# Altium project veniceBienale-IRFan-B.PrjPCB
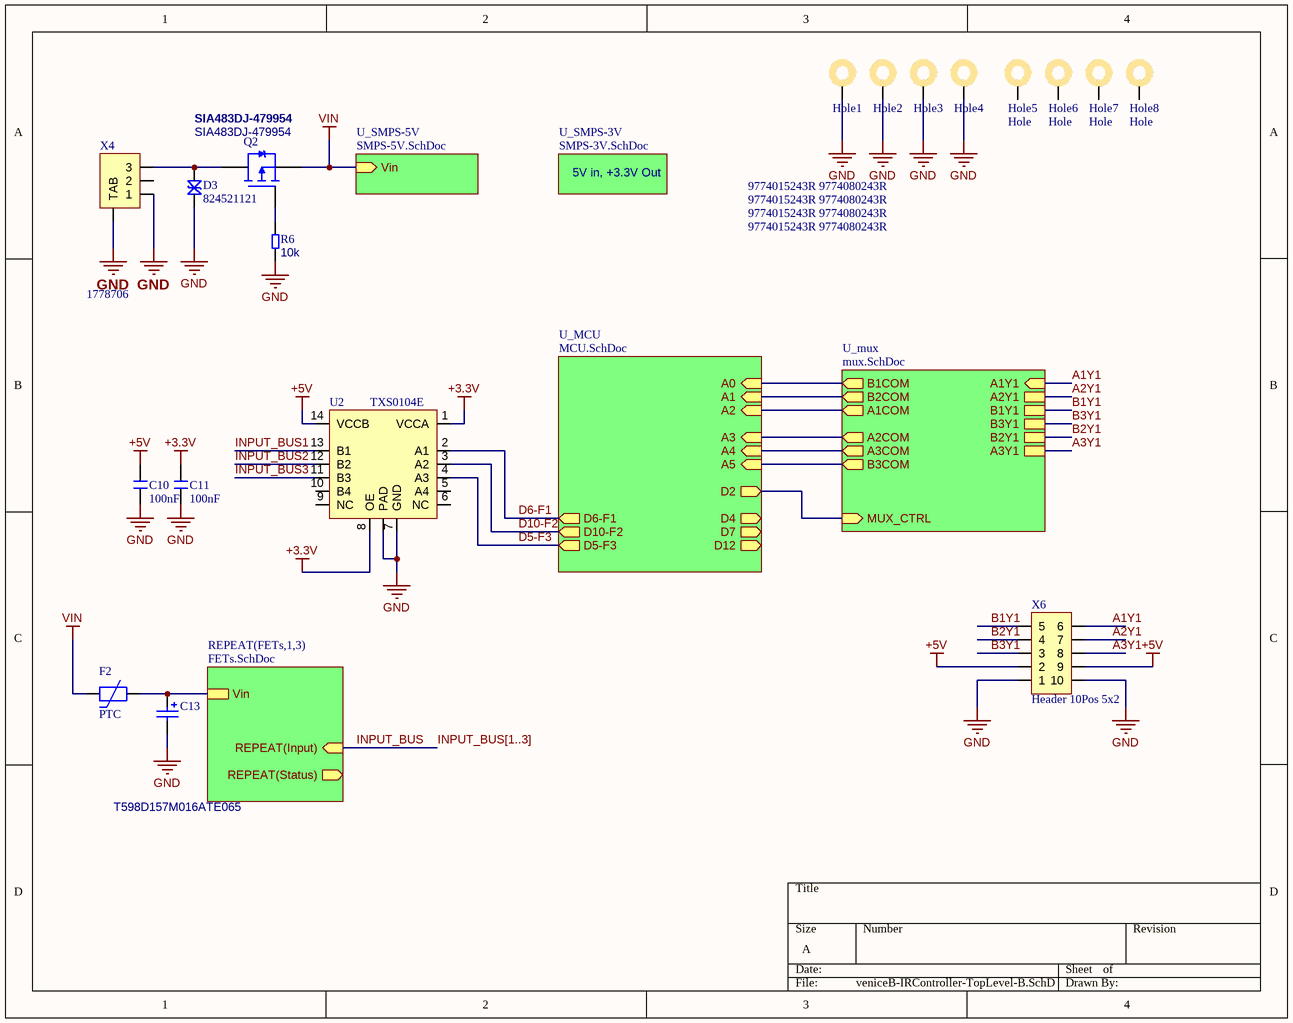
[diagram p0: veniceB-IRController-TopLevel-B.SchDoc]
6 sheets, 98 parts. Net scope: hierarchical (ports join the sheet entries above them; power ports are global).
Board file: veniceBienale-IRFan-B.PcbDoc
Sheets:
  veniceB-IRController-TopLevel-B.SchDoc
    U_MCU = MCU.SchDoc
    FETs1 = FETs.SchDoc
    FETs2 = FETs.SchDoc
    FETs3 = FETs.SchDoc
    U_SMPS-5V = SMPS-5V.SchDoc
    U_SMPS-3V = SMPS-3V.SchDoc
    U_mux = mux.SchDoc

## Sheet veniceB-IRController-TopLevel-B.SchDoc
size A

### Parts
C10  100nF  [C0603_N]
C11  100nF  [C0603_N]
C13  T598D157M016ATE065  [2917 - Case D]
D3  824521121  [DO214AC SMA]
F2  PTC  [1812]
Hole1  9774015243R 9774080243R  [Insert-Thread-SMD-M2]
Hole2  9774015243R 9774080243R  [Insert-Thread-SMD-M2]
Hole3  9774015243R 9774080243R  [Insert-Thread-SMD-M2]
Hole4  9774015243R 9774080243R  [Insert-Thread-SMD-M2]
Hole5  Hole  [M2.5 HOLE]
Hole6  Hole  [M2.5 HOLE]
Hole7  Hole  [M2.5 HOLE]
Hole8  Hole  [M2.5 HOLE]
Q2  SIA483DJ-479954  [SC70-6L]
R6  10k  [R0603]
U2  TXS0104E  [QFN-14]
X4  1778706  [PTSM-3W-V-SMD]
X6  Header 10Pos 5x2  [Header 5x2 SMD 2.54mm]

### Sub-sheets
REPEAT(FETs,1,3) = FETs.SchDoc: REPEAT(Input) (in), REPEAT(Status) (out), Vin
U_MCU = MCU.SchDoc: D10-F2 (out), D6-F1 (out), D5-F3 (out), D7 (out), D12 (out), D2 (out), D4 (out), A4 (in), A2 (in), A0 (in), A1 (in), A3 (in), A5 (in)
U_mux = mux.SchDoc: MUX_CTRL (in), A2COM (out), A1COM (out), B3COM (out), A3COM (out), B2COM (out), B1COM (out), A1Y1 (in), A2Y1, B1Y1, B3Y1, B2Y1, A3Y1
U_SMPS-3V = SMPS-3V.SchDoc: no entries
U_SMPS-5V = SMPS-5V.SchDoc: Vin (in)

### Nets
+3.3V: C11.1 U2.1(VCCA) U2.8(OE)
+5V: C10.1 U2.14(VCCB) X6.2 X6.9
GND: C10.2 C11.2 C13.2 D3.1 Hole1.1 Hole2.1 Hole3.1 Hole4.1 R6.1 U2.7(GND) U2.PAD X4.1 X4.TAB X6.1 X6.10
VIN: F2.1 Q2.S ; sheet U_SMPS-5V/Vin
A1: sheet U_MCU/A1, sheet U_mux/B2COM
A1Y1: X6.6 ; sheet U_mux/A1Y1
A2: sheet U_MCU/A2, sheet U_mux/A1COM
A2Y1: X6.7 ; sheet U_mux/A2Y1
A3Y1: X6.8 ; sheet U_mux/A3Y1
A5: sheet U_MCU/A5, sheet U_mux/B3COM
B1Y1: X6.5 ; sheet U_mux/B1Y1
B2Y1: X6.4 ; sheet U_mux/B2Y1
B3Y1: X6.3 ; sheet U_mux/B3Y1
D5-F3: U2.4(A3) ; sheet U_MCU/D5-F3
D6-F1: U2.2(A1) ; sheet U_MCU/D6-F1
D10-F2: U2.3(A2) ; sheet U_MCU/D10-F2
INPUT_BUS: sheet REPEAT(FETs,1,3)/REPEAT(Input)
INPUT_BUS1: U2.13(B1)
INPUT_BUS2: U2.12(B2)
INPUT_BUS3: U2.11(B3)
MUX_CTRL: sheet U_MCU/D2, sheet U_mux/MUX_CTRL
NetC13_1: C13.1 F2.2 ; sheet REPEAT(FETs,1,3)/Vin
NetD3_2: D3.2 Q2.D X4.3
NetQ2_G: Q2.G R6.2
NetR7_6: sheet U_MCU/A4, sheet U_mux/A3COM
NetR7_7: sheet U_MCU/A3, sheet U_mux/A2COM
NetR9_8: sheet U_MCU/A0, sheet U_mux/B1COM

Not connected (* = marked no-connect by the designer): Hole5 1; Hole6 1; Hole7 1; Hole8 1; U2 5(A4) 6(NC) 9(NC) 10(B4); X4 2

### Buses and harness runs
bus INPUT_BUS[1..3]

### Notes on the sheet
- 5V in, +3.3V Out

### Library data of the parts
C10 C11 = Capacitor: Capacitor MLCC; Manufacturer: Yageo; Manufacturer Part Number: CC0603KRX7R9BB104; Tolerance (%): 10; Category: Capacitor; Package: 0603; Value: 100nF; Supplier Part Number 1: 1362556; Supplier 1: Farnell; ComponentLink1URL: http://www.yageo.com; ComponentLink1Description: Manufacturer Website; Voltage Rating (Volts): *; Supplier 2: Digi-Key; Supplier Part Number 2: 311-1344-1-ND
C13 = Capacitor Polarized: Polarized Cap; Published: 17-Jul-2002; LatestRevisionDate: 19-Mar-2004; LatestRevisionNote: Silkscreen dimensions re-sized.; DatasheetDocument: Mar-2001; PackageDocument: Mar-2001; PackageReference: D; Publisher: Altium Limited; Code_JEITA: 7343-31; ComponentLink1Description: Manufacturer Link; ComponentLink1URL: http://www.kemet.com/; ComponentLink2Description: Datasheet; ComponentLink2URL: http://www.kemet.com/kemet/web/homepage/kechome.nsf/vapubfilesname/F3102TA.pdf/$file/F3102TA.pdf; Value: T598D157M016ATE065
D3 = TVS Bidirectional
F2 = PTC: PTC, Resettable Fuse
Hole1-Hole4 = Hole
Q2 = MOSFET P CH: Value: SIA483DJ-479954
R6 = Resistor: Published: 17-Dec-2003; LatestRevisionDate: 19-Mar-2004; LatestRevisionNote: Silkscreen size reduced.; PackageDocument: Mar-2003; PackageReference: 3-0603; Publisher: Altium Limited; Code_IPC: 1608 [0603]; ComponentLink1Description: Manufacturer Link; ComponentLink1URL: http://www.panasonic.com/industrial/components/resistive_products.htm; ComponentLink2Description: Datasheet; ComponentLink2URL: http://www.panasonic.com/industrial/components/pdf/AOA0000CE2.pdf; Value: 10k
X4 = Connector 3W - TAB

## Sheet MCU.SchDoc
size A
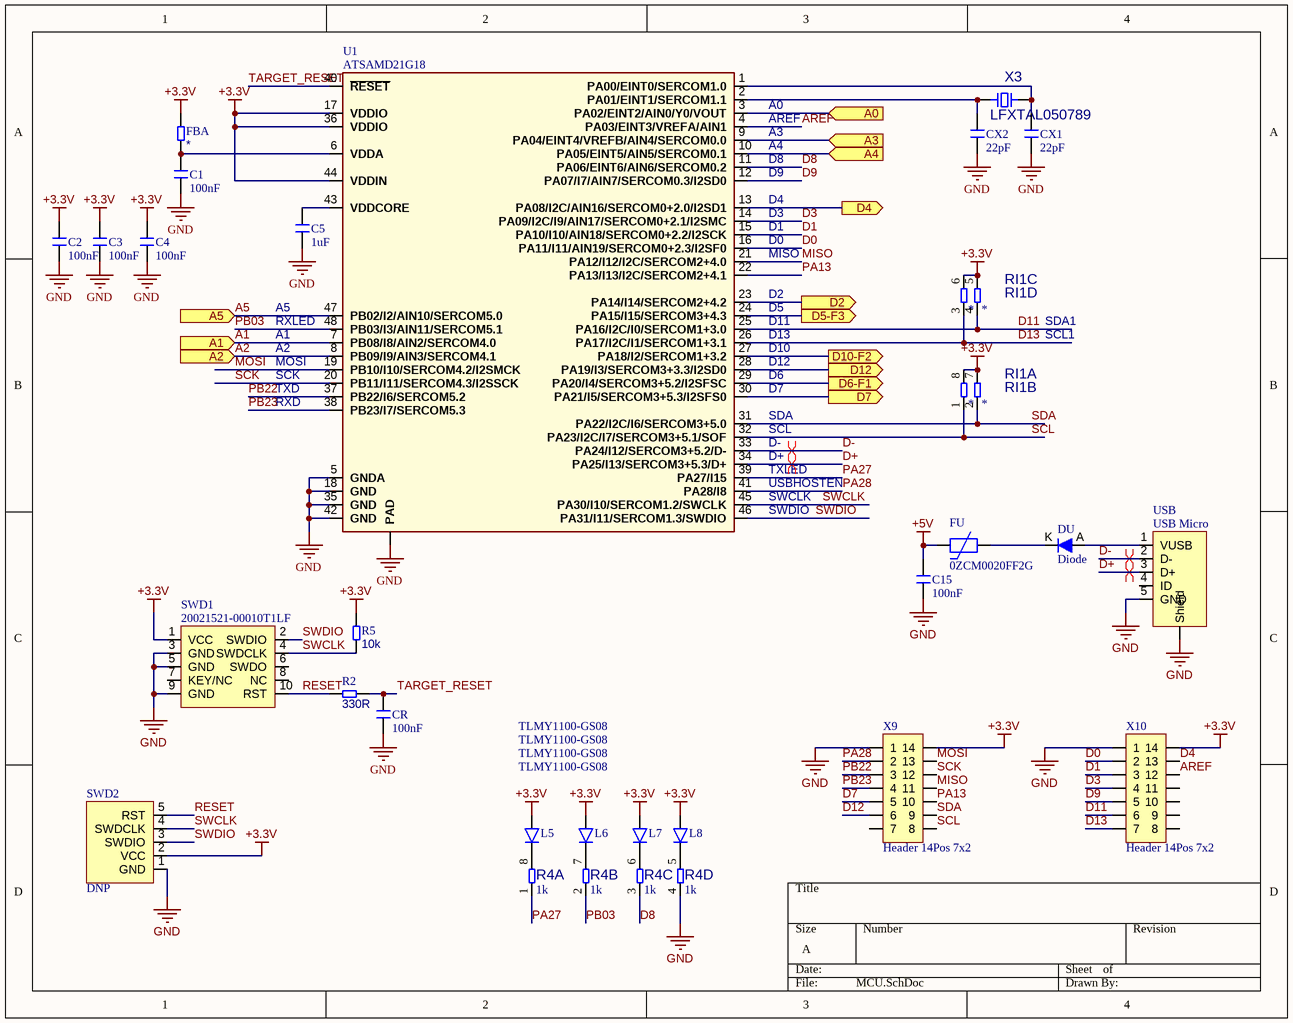
[diagram p1: MCU.SchDoc]

### Parts
C1  100nF  [C0603_N]
C2  100nF  [C0603_N]
C3  100nF  [C0603_N]
C4  100nF  [C0603_N]
C5  1uF  [C0603_N]
C15  100nF  [C0603_N]
CR  100nF  [C0603_N]
CX1  22pF  [C0603_N]
CX2  22pF  [C0603_N]
DU  Diode  [SOD323F]
FBA  Ferrite  [R0603]  (value not drawn)
FU  0ZCM0020FF2G  [PTC0603]
L5  TLMY1100-GS08  [LED 0603 Reverse]
L6  TLMY1100-GS08  [LED 0603 Reverse]
L7  TLMY1100-GS08  [LED 0603 Reverse]
L8  TLMY1100-GS08  [LED 0603 Reverse]
R2  330R  [R0603]
R4  1k  [YC164]  (parts A,B,C,D of 4)
R5  10k  [R0603]
RI1  4k7  [YC164]  (value not drawn)  (parts A,B,C,D of 4)
SWD1  20021521-00010T1LF  [Header 10P 50mil]
SWD2  DNP  [SWD 5Pin SMD]
U1  ATSAMD21G18  [QFN48_M]
USB  USB Micro  [USB Micro]
X3  LFXTAL050789  [Crystal 0805]
X9  Header 14Pos 7x2  [Header 7x2 SMD 2.54mm]
X10  Header 14Pos 7x2  [Header 7x2 SMD 2.54mm]

### Ports
A0 (in), A1 (in), A2 (in), A3 (in), A4 (in), A5 (in), D2 (out), D4 (out), D5-F3 (out), D6-F1 (out), D7 (out), D10-F2 (out), D12 (out)

### Nets
+3.3V: C2.1 C3.1 C4.1 FBA.2 L5.2(A) L6.2(A) L7.2(A) L8.2(A) R5.2 RI1.5 RI1.6 RI1.7 RI1.8 SWD1.1(VCC) SWD2.2(VCC) U1.17(VDDIO) U1.36(VDDIO) U1.44(VDDIN) X9.14 X10.14
+5V: C15.1 FU.1
GND: C1.2 C2.2 C3.2 C4.2 C5.2 C15.2 CR.2 CX1.2 CX2.2 R4.4 SWD1.3(GND) SWD1.5(GND) SWD1.9(GND) SWD2.1(GND) U1.5(GNDA) U1.18(GND) U1.35(GND) U1.42(GND) U1.49(PAD) USB.5(GND) USB.Shield X9.1 X10.1
A1: U1.7(PB08/I8/AIN2/SERCOM4.0) ; port A1
A2: U1.8(PB09/I9/AIN3/SERCOM4.1) ; port A2
A5: U1.47(PB02/I2/AIN10/SERCOM5.0) ; port A5
AREF: U1.4(PA03/EINT3/VREFA/AIN1) X10.12
D0: U1.16(PA11/I11/AIN19/SERCOM0+2.3/I2SF0) X10.2
D1: U1.15(PA10/I10/AIN18/SERCOM0+2.2/I2SCK) X10.3
D3: U1.14(PA09/I2C/I9/AIN17/SERCOM0+2.1/I2SMC) X10.4
D4: X10.13
D5-F3: U1.24(PA15/I15/SERCOM3+4.3) ; port D5-F3
D6-F1: U1.29(PA20/I4/SERCOM3+5.2/I2SFSC) ; port D6-F1
D7: X9.5
D8: R4.3 U1.11(PA06/EINT6/AIN6/SERCOM0.2)
D9: U1.12(PA07/I7/AIN7/SERCOM0.3/I2SD0) X10.5
D10-F2: U1.27(PA18/I2/SERCOM1+3.2) ; port D10-F2
D11: RI1.4 U1.25(PA16/I2C/I0/SERCOM1+3.0) X10.6
D12: X9.6
D13: RI1.3 U1.26(PA17/I2C/I1/SERCOM1+3.1) X10.7
D+: U1.34(PA25/I13/SERCOM3+5.3/D+) USB.3(D+)
D-: U1.33(PA24/I12/SERCOM3+5.2/D-) USB.2(D-)
MISO: U1.21(PA12/I12/I2C/SERCOM2+4.0) X9.11
MOSI: U1.19(PB10/I10/SERCOM4.2/I2SMCK) X9.13
MUX_CTRL: U1.23(PA14/I14/SERCOM2+4.2) ; port D2
PA13: U1.22(PA13/I13/I2C/SERCOM2+4.1) X9.10
PA27: R4.1 U1.39(PA27/I15)
PA28: U1.41(PA28/I8) X9.2
PB03: R4.2 U1.48(PB03/I3/AIN11/SERCOM5.1)
PB22: U1.37(PB22/I6/SERCOM5.2) X9.3
PB23: U1.38(PB23/I7/SERCOM5.3) X9.4
RESET: R2.1 SWD1.10(RST) SWD2.5(RST)
SCK: U1.20(PB11/I11/SERCOM4.3/I2SSCK) X9.12
SCL: RI1.1 U1.32(PA23/I2C/I7/SERCOM3+5.1/SOF) X9.8
SDA: RI1.2 U1.31(PA22/I2C/I6/SERCOM3+5.0) X9.9
SWCLK: R5.1 SWD1.4(SWDCLK) SWD2.4(SWDCLK) U1.45(PA30/I10/SERCOM1.2/SWCLK)
SWDIO: SWD1.2(SWDIO) SWD2.3(SWDIO) U1.46(PA31/I11/SERCOM1.3/SWDIO)
TARGET_RESET: CR.1 R2.2 U1.40(~{RESET})
NetC1_1: C1.1 FBA.1 U1.6(VDDA)
NetC5_1: C5.1 U1.43(VDDCORE)
NetCX1_1: CX1.1 U1.1(PA00/EINT0/SERCOM1.0) X3.2
NetCX2_1: CX2.1 U1.2(PA01/EINT1/SERCOM1.1) X3.1
NetDU_A: DU.A USB.1(VUSB)
NetDU_K: DU.K FU.2
NetL5_1: L5.1(K) R4.8
NetL6_1: L6.1(K) R4.7
NetL7_1: L7.1(K) R4.6
NetL8_1: L8.1(K) R4.5
NetR7_6: U1.10(PA05/EINT5/AIN5/SERCOM0.1) ; port A4
NetR7_7: U1.9(PA04/EINT4/VREFB/AIN4/SERCOM0.0) ; port A3
NetR9_8: U1.3(PA02/EINT2/AIN0/Y0/VOUT) ; port A0
NetU1_13: U1.13(PA08/I2C/AIN16/SERCOM0+2.0/I2SD1) ; port D4
NetU1_28: U1.28(PA19/I3/SERCOM3+3.3/I2SD0) ; port D12
NetU1_30: U1.30(PA21/I5/SERCOM3+5.3/I2SFS0) ; port D7

Not connected (* = marked no-connect by the designer): SWD1 6(SWDO) 7(KEY/NC) 8(NC); USB 4(ID); X9 7; X10 8 9 10 11

### Layout directives
differential pair: D+, D-

### Notes on the sheet
- SDA1
- SCL1
- (in symbol ATSAMD21G18) A0; AREF; A3; A4; D8; D9; D4; D3; D1; D0; MISO; D2; A5; D5; RXLED; D11; A1; D13; A2; D10; MOSI; D12; SCK; D6; TXD; D7; RXD; SDA; SCL; D-; D+; TXLED; USBHOSTEN; SWCLK; SWDIO

### Library data of the parts
C1-C5 C15 CR CX1 CX2 = Capacitor: as C10 on sheet veniceB-IRController-TopLevel-B; Category: Capacitor; Package: 0603; Supplier Part Number 1: 1362556; Supplier 1: Farnell; ComponentLink1URL: http://www.yageo.com; ComponentLink1Description: Manufacturer Website; Voltage Rating (Volts): *; Supplier 2: Digi-Key; Supplier Part Number 2: 311-1344-1-ND
  C1-C4 C15 CR: Value: 100nF
  C5: Value: 1uF
  CX1 CX2: Value: 22pF
FBA R2 R5 = Resistor: Published: 17-Dec-2003; LatestRevisionDate: 19-Mar-2004; LatestRevisionNote: Silkscreen size reduced.; PackageDocument: Mar-2003; PackageReference: 3-0603; Publisher: Altium Limited; Code_IPC: 1608 [0603]; ComponentLink1Description: Manufacturer Link; ComponentLink1URL: http://www.panasonic.com/industrial/components/resistive_products.htm; ComponentLink2Description: Datasheet; ComponentLink2URL: http://www.panasonic.com/industrial/components/pdf/AOA0000CE2.pdf
  FBA: Value: *
  R2: Value: 330R
  R5: Value: 10k
FU = PTC: PTC, Resettable Fuse
L5-L8 = LED
R4 RI1 = Resistor Array - 4P
  R4: Value: 1k
  RI1: Value: *
SWD1 = SWD
SWD2 = SWD 5 Pin
X3 = Crystal: Value: LFXTAL050789

## Sheet FETs.SchDoc
size A
Used 3 times, as channels FETs1, FETs2, FETs3. Parts and nets are listed once, with the designators drawn on the sheet.
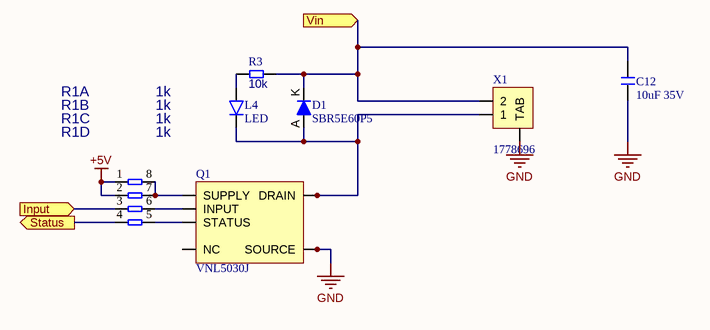
[diagram p2: FETs.SchDoc]

### Parts
C12  10uF 35V  [C1210_N]
D1  SBR5E60P5  [PowerDI5]
L4  LED  [LED 0603 Reverse]
Q1  VNL5030J  [PowerSSO-12]
R1  1k  [YC164]  (parts A,B,C,D of 4)
R3  10k  [R0603]
X1  1778696  [PTSM-2W-V-SMD]

### Ports
Input (in), Status (out), Vin (in)

### Nets
+5V: R1.1 R1.2
GND: C12.2 Q1.7(SOURCE) Q1.8(SOURCE) Q1.9(SOURCE) Q1.10(SOURCE) Q1.11(SOURCE) Q1.12(SOURCE) X1.TAB
Input: R1.3 ; port Input
Status: R1.4 ; port Status
Vin: C12.1 D1.K R3.2 X1.2 ; port Vin
NetD1_A: D1.A L4.1(K) Q1.1(DRAIN) Q1.6(DRAIN) Q1.PAD(DRAIN) X1.1
NetL4_2: L4.2(A) R3.1
NetQ1_2: Q1.2(SUPPLY) R1.7 R1.8
NetQ1_3: Q1.3(INPUT) R1.6
NetQ1_4: Q1.4(STATUS) R1.5

Not connected (* = marked no-connect by the designer): Q1 5(NC)

### Channels
FETs1: designators C12=FETs1_C12 D1=FETs1_D1 L4=FETs1_L4 Q1=FETs1_Q1 R1=FETs1_R1 R3=FETs1_R3 X1=FETs1_X1; ports Input=INPUT_BUS1 Status=NetFETs1_R1_4 Vin=NetC13_1
FETs2: designators C12=FETs2_C12 D1=FETs2_D1 L4=FETs2_L4 Q1=FETs2_Q1 R1=FETs2_R1 R3=FETs2_R3 X1=FETs2_X1; ports Input=INPUT_BUS2 Status=NetFETs2_R1_4 Vin=NetC13_1
FETs3: designators C12=FETs3_C12 D1=FETs3_D1 L4=FETs3_L4 Q1=FETs3_Q1 R1=FETs3_R1 R3=FETs3_R3 X1=FETs3_X1; ports Input=INPUT_BUS3 Status=NetFETs3_R1_4 Vin=NetC13_1

### Library data of the parts
C12 = Capacitor: as C10 on sheet veniceB-IRController-TopLevel-B; Category: Capacitor; Package: 0603; Value: 10uF 35V; Supplier Part Number 1: 1362556; Supplier 1: Farnell; ComponentLink1URL: http://www.yageo.com; ComponentLink1Description: Manufacturer Website; Voltage Rating (Volts): *; Supplier 2: Digi-Key; Supplier Part Number 2: 311-1344-1-ND
D1 = Diode
Q1 = VNL5030JTR
R1 = Resistor Array - 4P: Value: *
R3 = Resistor: Published: 17-Dec-2003; LatestRevisionDate: 19-Mar-2004; LatestRevisionNote: Silkscreen size reduced.; PackageDocument: Mar-2003; PackageReference: 3-0603; Publisher: Altium Limited; Code_IPC: 1608 [0603]; ComponentLink1Description: Manufacturer Link; ComponentLink1URL: http://www.panasonic.com/industrial/components/resistive_products.htm; ComponentLink2Description: Datasheet; ComponentLink2URL: http://www.panasonic.com/industrial/components/pdf/AOA0000CE2.pdf; Value: 10k
X1 = Connector 2W - TAB

## Sheet SMPS-5V.SchDoc
size A
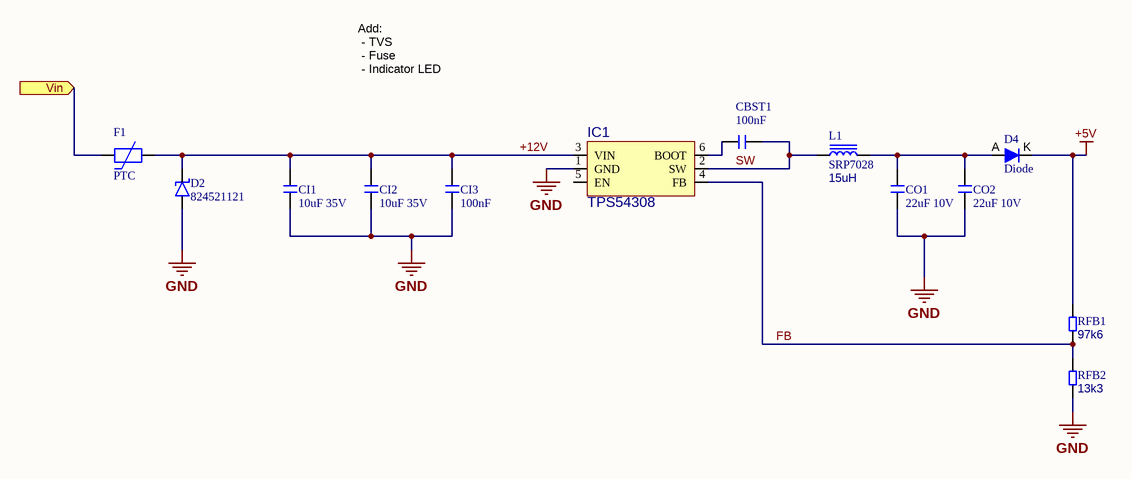
[diagram p3: SMPS-5V.SchDoc]

### Parts
CBST1  100nF  [C0603_N]
CI1  10uF 35V  [C1210_N]
CI2  10uF 35V  [C1210_N]
CI3  100nF  [C0603_N]
CO1  22uF 10V  [C1210_N]
CO2  22uF 10V  [C1210_N]
D2  824521121  [DO214AC SMA]
D4  Diode  [SOD323F]
F1  PTC  [C1206_N]
IC1  TPS54308  [SOT23]
L1  SRP7028  value 15uH  [Inductor SRP7028]
RFB1  value 97k6  [R0603]  (hidden comment: 100k)
RFB2  value 13k3  [R0603]  (hidden comment: 13k5)

### Ports
Vin (in)

### Nets
+5V: D4.K RFB1.2
GND: CI1.2 CI2.2 CI3.2 CO1.2 CO2.2 D2.1 IC1.1(GND) RFB2.1
VIN: F1.1 ; port Vin
+12V: CI1.1 CI2.1 CI3.1 D2.2 F1.2 IC1.3(VIN)
FB: IC1.4(FB) RFB1.1 RFB2.2
SW: CBST1.2 IC1.2(SW) L1.1
NetCBST1_1: CBST1.1 IC1.6(BOOT)
NetCO1_1: CO1.1 CO2.1 D4.A L1.2

Not connected (* = marked no-connect by the designer): IC1 5(EN)

### Notes on the sheet
- Add:
  - TVS
  - Fuse
  - Indicator LED

### Library data of the parts
CBST1 CI1 CI2 CO1 CO2 = Capacitor: as C10 on sheet veniceB-IRController-TopLevel-B; Category: Capacitor; Package: 0603; Supplier Part Number 1: 1362556; Supplier 1: Farnell; ComponentLink1URL: http://www.yageo.com; ComponentLink1Description: Manufacturer Website; Supplier 2: Digi-Key; Supplier Part Number 2: 311-1344-1-ND
  CBST1: Value: 100nF; Voltage Rating (Volts): *
  CI1 CI2: Value: 10uF 35V; Voltage Rating (Volts): 35V
  CO1 CO2: Value: 22uF 10V; Voltage Rating (Volts): 10V
CI3 = Capacitor: Capacitor MLCC; Manufacturer: Yageo; Manufacturer Part Number: CC0603KRX7R9BB104; Tolerance (%): 10; Voltage Rating (Volts): 50V; Category: Capacitor; Package: 0603; Value: 100nF; Supplier Part Number 1: 1362556; Supplier 1: Farnell; ComponentLink1URL: http://www.yageo.com; ComponentLink1Description: Manufacturer Website; Supplier 2: Digi-Key; Supplier Part Number 2: 311-1344-1-ND
D2 = TVS
F1 = PTC: PTC, Resettable Fuse
IC1 = TPS54308: Buck Converter
L1 = Inductor
RFB1 RFB2 = Resistor: Published: 17-Dec-2003; LatestRevisionDate: 19-Mar-2004; LatestRevisionNote: Silkscreen size reduced.; PackageDocument: Mar-2003; PackageReference: 3-0603; Publisher: Altium Limited; Code_IPC: 1608 [0603]; ComponentLink1Description: Manufacturer Link; ComponentLink1URL: http://www.panasonic.com/industrial/components/resistive_products.htm; ComponentLink2Description: Datasheet; ComponentLink2URL: http://www.panasonic.com/industrial/components/pdf/AOA0000CE2.pdf

## Sheet SMPS-3V.SchDoc
size A
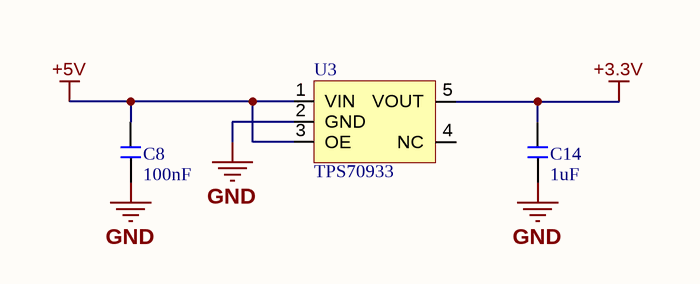
[diagram p4: SMPS-3V.SchDoc]

### Parts
C8  100nF  [C0603_N]
C14  1uF  [C0603_N]
U3  TPS70933  [SOT23-5_N]

### Nets
+3.3V: C14.1 U3.5(VOUT)
+5V: C8.1 U3.1(VIN) U3.3(OE)
GND: C8.2 C14.2 U3.2(GND)

Not connected (* = marked no-connect by the designer): U3 4(NC)

### Library data of the parts
C8 C14 = Capacitor: as C10 on sheet veniceB-IRController-TopLevel-B; Category: Capacitor; Package: 0603; Supplier Part Number 1: 1362556; Supplier 1: Farnell; ComponentLink1URL: http://www.yageo.com; ComponentLink1Description: Manufacturer Website; Voltage Rating (Volts): *; Supplier 2: Digi-Key; Supplier Part Number 2: 311-1344-1-ND
  C8: Value: 100nF
  C14: Value: 1uF
U3 = XC6222

## Sheet mux.SchDoc
size A
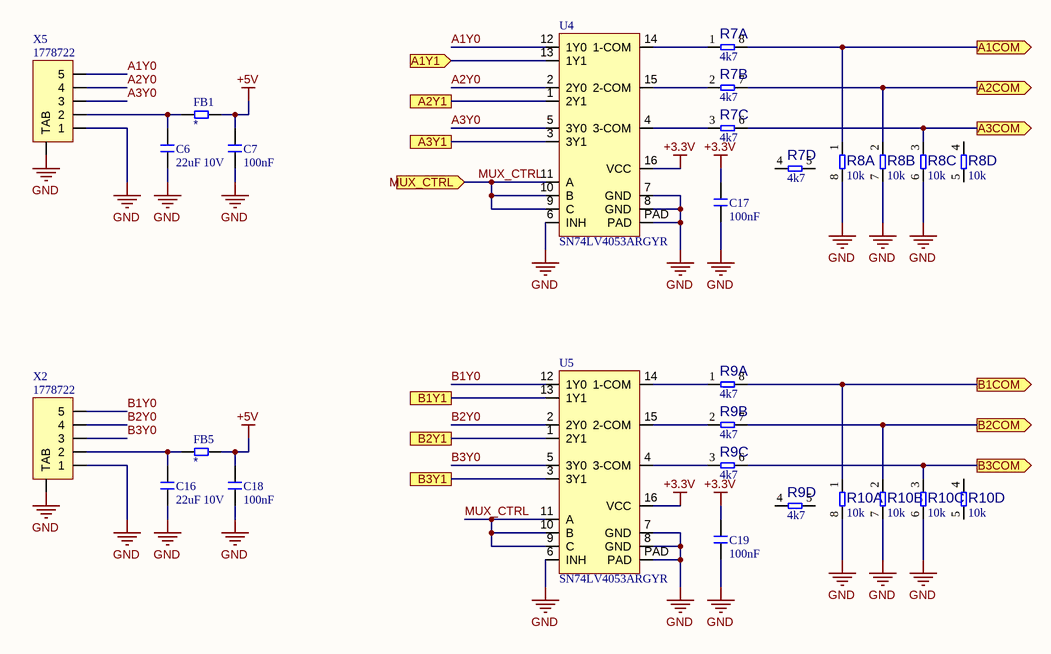
[diagram p5: mux.SchDoc]

### Parts
C6  22uF 10V  [C1210_N]
C7  100nF  [C0603_N]
C16  22uF 10V  [C1210_N]
C17  100nF  [C0603_N]
C18  100nF  [C0603_N]
C19  100nF  [C0603_N]
FB1  Ferrite  [R0603]  (value not drawn)
FB5  Ferrite  [R0603]  (value not drawn)
R7  4k7  [YC164]  (parts A,B,C,D of 4)
R8  10k  [YC164]  (parts A,B,C,D of 4)
R9  4k7  [YC164]  (parts A,B,C,D of 4)
R10  10k  [YC164]  (parts A,B,C,D of 4)
U4  SN74LV4053ARGYR  [QFN16]
U5  SN74LV4053ARGYR  [QFN16]
X2  1778722  [PTSM-5W-V-SMD]
X5  1778722  [PTSM-5W-V-SMD]

### Ports
A1COM (out), A1Y1 (in), A2COM (out), A2Y1, A3COM (out), A3Y1, B1COM (out), B1Y1, B2COM (out), B2Y1, B3COM (out), B3Y1, MUX_CTRL (in)

### Nets
+3.3V: C17.1 C19.1 U4.16(VCC) U5.16(VCC)
+5V: C7.1 C18.1 FB1.2 FB5.2
GND: C6.2 C7.2 C16.2 C17.2 C18.2 C19.2 R8.6 R8.7 R8.8 R10.6 R10.7 R10.8 U4.6(INH) U4.7(GND) U4.8(GND) U4.PAD U5.6(INH) U5.7(GND) U5.8(GND) U5.PAD X2.1 X2.TAB X5.1 X5.TAB
A1: R9.7 R10.2 ; port B2COM
A1Y0: U4.12(1Y0) X5.5
A1Y1: U4.13(1Y1) ; port A1Y1
A2: R7.8 R8.1 ; port A1COM
A2Y0: U4.2(2Y0) X5.4
A2Y1: U4.1(2Y1) ; port A2Y1
A3Y0: U4.5(3Y0) X5.3
A3Y1: U4.3(3Y1) ; port A3Y1
A5: R9.6 R10.3 ; port B3COM
B1Y0: U5.12(1Y0) X2.5
B1Y1: U5.13(1Y1) ; port B1Y1
B2Y0: U5.2(2Y0) X2.4
B2Y1: U5.1(2Y1) ; port B2Y1
B3Y0: U5.5(3Y0) X2.3
B3Y1: U5.3(3Y1) ; port B3Y1
MUX_CTRL: U4.9(C) U4.10(B) U4.11(A) U5.9(C) U5.10(B) U5.11(A) ; port MUX_CTRL
NetC6_1: C6.1 FB1.1 X5.2
NetC16_1: C16.1 FB5.1 X2.2
NetR7_1: R7.1 U4.14(1-COM)
NetR7_2: R7.2 U4.15(2-COM)
NetR7_3: R7.3 U4.4(3-COM)
NetR7_6: R7.6 R8.3 ; port A3COM
NetR7_7: R7.7 R8.2 ; port A2COM
NetR9_1: R9.1 U5.14(1-COM)
NetR9_2: R9.2 U5.15(2-COM)
NetR9_3: R9.3 U5.4(3-COM)
NetR9_8: R9.8 R10.1 ; port B1COM

Not connected (* = marked no-connect by the designer): R7 4 5; R8 4 5; R9 4 5; R10 4 5

### Library data of the parts
C6 C7 C16-C19 = Capacitor: as C10 on sheet veniceB-IRController-TopLevel-B; Category: Capacitor; Package: 0603; Supplier Part Number 1: 1362556; Supplier 1: Farnell; ComponentLink1URL: http://www.yageo.com; ComponentLink1Description: Manufacturer Website; Voltage Rating (Volts): *; Supplier 2: Digi-Key; Supplier Part Number 2: 311-1344-1-ND
  C6 C16: Value: 22uF 10V
  C7 C17-C19: Value: 100nF
FB1 FB5 = Resistor: Published: 17-Dec-2003; LatestRevisionDate: 19-Mar-2004; LatestRevisionNote: Silkscreen size reduced.; PackageDocument: Mar-2003; PackageReference: 3-0603; Publisher: Altium Limited; Code_IPC: 1608 [0603]; ComponentLink1Description: Manufacturer Link; ComponentLink1URL: http://www.panasonic.com/industrial/components/resistive_products.htm; ComponentLink2Description: Datasheet; ComponentLink2URL: http://www.panasonic.com/industrial/components/pdf/AOA0000CE2.pdf; Value: *
R7-R10 = Resistor Array - 4P
  R7 R9: Value: 4k7
  R8 R10: Value: 10k
X2 X5 = Connector 5W - TAB

## Nets that join several sheets
+3.3V: veniceB-IRController-TopLevel-B (C11.1 U2.1 U2.8), MCU (20 pins), SMPS-3V (C14.1 U3.5), mux (C17.1 C19.1 U4.16 U5.16)
+5V: veniceB-IRController-TopLevel-B (C10.1 U2.14 X6.2 X6.9), MCU (C15.1 FU.1), FETs1 (FETs1_R1.1 FETs1_R1.2), FETs2 (FETs2_R1.1 FETs2_R1.2), FETs3 (FETs3_R1.1 FETs3_R1.2), SMPS-5V (D4.K RFB1.2), SMPS-3V (C8.1 U3.1 U3.3), mux (C7.1 C18.1 FB1.2 FB5.2)
GND: veniceB-IRController-TopLevel-B (15 pins), MCU (23 pins), FETs1 (8 pins), FETs2 (8 pins), FETs3 (8 pins), SMPS-5V (8 pins), SMPS-3V (C8.2 C14.2 U3.2), mux (24 pins)
VIN: veniceB-IRController-TopLevel-B (F2.1 Q2.S), SMPS-5V (F1.1)
A1: MCU (U1.7), mux (R9.7 R10.2)
A1Y1: veniceB-IRController-TopLevel-B (X6.6), mux (U4.13)
A2: MCU (U1.8), mux (R7.8 R8.1)
A2Y1: veniceB-IRController-TopLevel-B (X6.7), mux (U4.1)
A3Y1: veniceB-IRController-TopLevel-B (X6.8), mux (U4.3)
A5: MCU (U1.47), mux (R9.6 R10.3)
B1Y1: veniceB-IRController-TopLevel-B (X6.5), mux (U5.13)
B2Y1: veniceB-IRController-TopLevel-B (X6.4), mux (U5.1)
B3Y1: veniceB-IRController-TopLevel-B (X6.3), mux (U5.3)
D5-F3: veniceB-IRController-TopLevel-B (U2.4), MCU (U1.24)
D6-F1: veniceB-IRController-TopLevel-B (U2.2), MCU (U1.29)
D10-F2: veniceB-IRController-TopLevel-B (U2.3), MCU (U1.27)
INPUT_BUS1: veniceB-IRController-TopLevel-B (U2.13), FETs1 (FETs1_R1.3)
INPUT_BUS2: veniceB-IRController-TopLevel-B (U2.12), FETs2 (FETs2_R1.3)
INPUT_BUS3: veniceB-IRController-TopLevel-B (U2.11), FETs3 (FETs3_R1.3)
MUX_CTRL: MCU (U1.23), mux (6 pins)
NetC13_1: veniceB-IRController-TopLevel-B (C13.1 F2.2), FETs1 (FETs1_C12.1 FETs1_D1.K FETs1_R3.2 FETs1_X1.2), FETs2 (FETs2_C12.1 FETs2_D1.K FETs2_R3.2 FETs2_X1.2), FETs3 (FETs3_C12.1 FETs3_D1.K FETs3_R3.2 FETs3_X1.2)
NetR7_6: MCU (U1.10), mux (R7.6 R8.3)
NetR7_7: MCU (U1.9), mux (R7.7 R8.2)
NetR9_8: MCU (U1.3), mux (R9.8 R10.1)